# Altium schematic sheet APM9328_CPU.SchDoc
size A3; Organization: NetModule AG; Address1: Meriedweg 11; Address2: CH-3172 Niederwangen; Address4: Switzerland
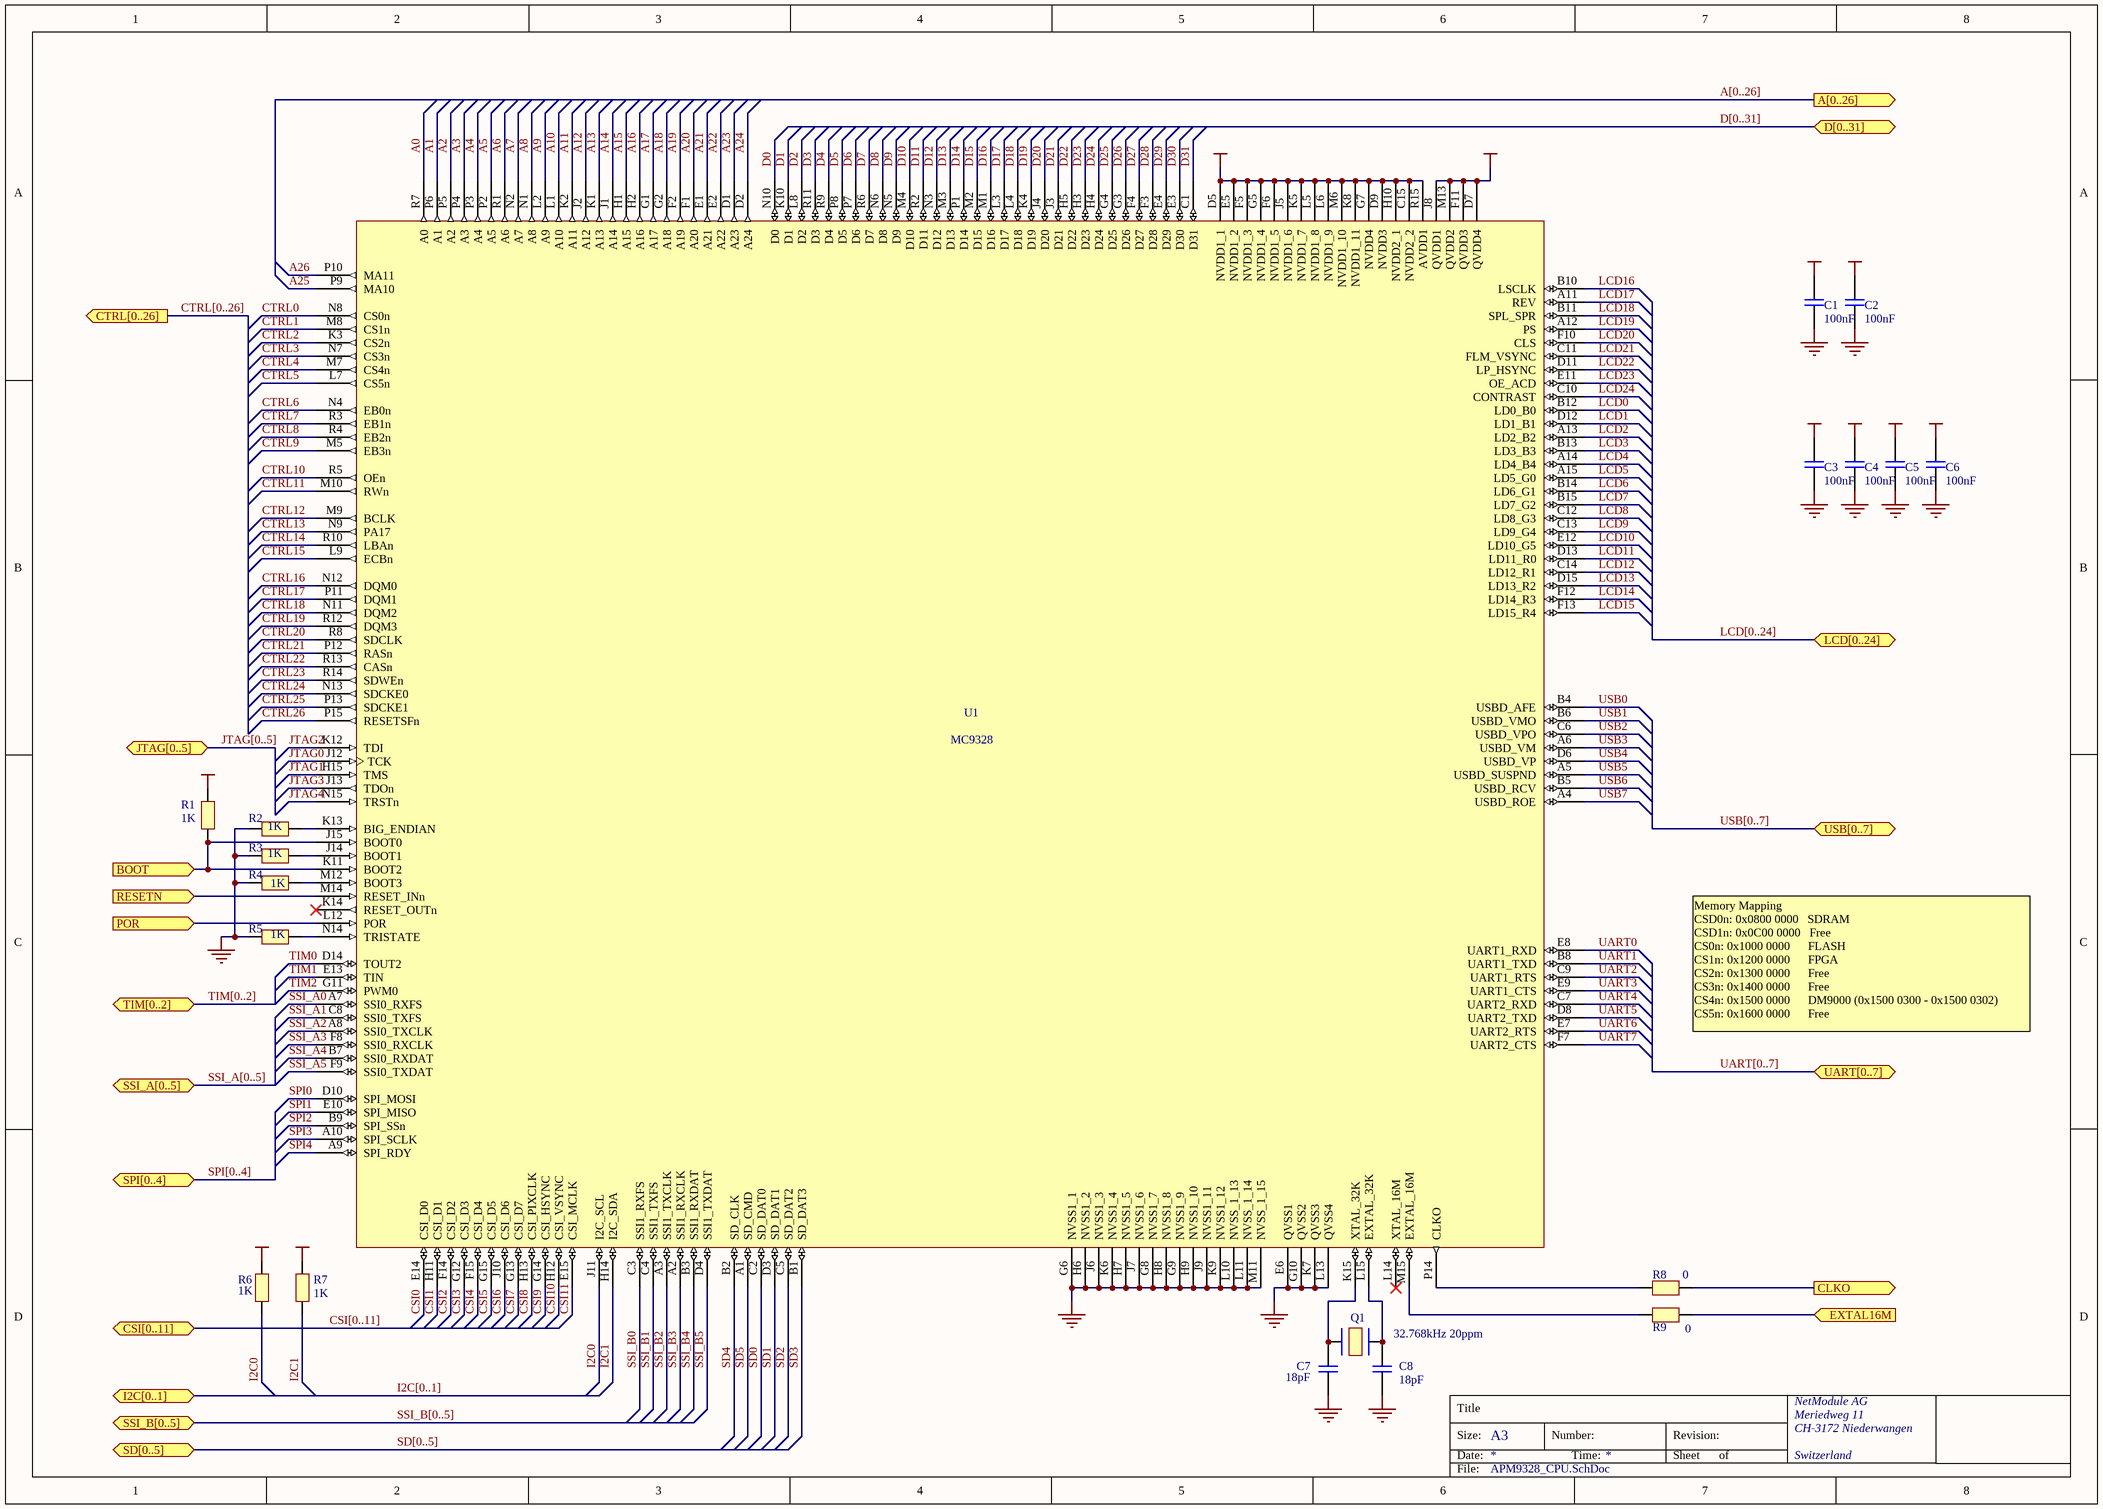
[diagram p0: APM9328_CPU.SchDoc]

## Parts
C1  100nF  [0402]
C2  100nF  [0402]
C3  100nF  [0402]
C4  100nF  [0402]
C5  100nF  [0402]
C6  100nF  [0402]
C7  18pF  [0402]
C8  18pF  [0402]
Q1  32.768kHz 20ppm  [Crystal_SMD_Cyl]
R1  1K  [0402]
R2  1K  [0402]
R3  1K  [0402]
R4  1K  [0402]
R5  1K  [0402]
R6  1K  [0402]
R7  1K  [0402]
R8  0  [0402]
R9  0  [0402]
U1  MC9328  [BGA225x15]

## Ports
A[0..26] (out), BOOT (in), CLKO (out), CSI[0..11] (bidir), CTRL[0..26] (out), D[0..31], EXTAL16M (in), I2C[0..1] (bidir), JTAG[0..5] (bidir), LCD[0..24] (bidir), POR (in), RESETN (in), SD[0..5], SPI[0..4], SSI_A[0..5] (bidir), SSI_B[0..5] (bidir), TIM[0..2], UART[0..7] (bidir), USB[0..7] (bidir)

## Nets
+1V8: C1.2 C2.2 U1.D7(QVDD4) U1.F11(QVDD3) U1.J8(QVDD1) U1.M13(QVDD2)
+3V3: C3.2 C4.2 C5.2 C6.2 R1.2 R6.2 R7.2 U1.C15(NVDD2_2) U1.D5(NVDD1_1) U1.D9(NVDD3) U1.E5(NVDD1_2) U1.F5(NVDD1_3) U1.F6(NVDD1_5) U1.G5(NVDD1_4) U1.G7(NVDD4) U1.H10(NVDD2_1) U1.J5(NVDD1_6) U1.K5(NVDD1_7) U1.K8(NVDD1_11) U1.L5(NVDD1_8) U1.L6(NVDD1_9) U1.M6(NVDD1_10) U1.R15(AVDD1)
GND: C1.1 C2.1 C3.1 C4.1 C5.1 C6.1 C7.1 C8.1 R2.1 R3.1 R4.1 R5.1 U1.E6(QVSS1) U1.G6(NVSS1_1) U1.G8(NVSS1_7) U1.G9(NVSS1_9) U1.G10(QVSS2) U1.H6(NVSS1_2) U1.H7(NVSS1_5) U1.H8(NVSS1_8) U1.H9(NVSS1_10) U1.J6(NVSS1_3) U1.J7(NVSS1_6) U1.J9(NVSS1_11) U1.K6(NVSS1_4) U1.K7(QVSS3) U1.K9(NVSS1_12) U1.L10(NVSS_1_13) U1.L11(NVSS_1_14) U1.L13(QVSS4) U1.M11(NVSS_1_15)
A0: U1.R7(A0)
A1: U1.P6(A1)
A2: U1.P5(A2)
A3: U1.P4(A3)
A4: U1.P3(A4)
A5: U1.P2(A5)
A6: U1.R1(A6)
A7: U1.N2(A7)
A8: U1.N1(A8)
A9: U1.L2(A9)
A10: U1.L1(A10)
A11: U1.K2(A11)
A12: U1.J2(A12)
A13: U1.K1(A13)
A14: U1.J1(A14)
A15: U1.H1(A15)
A16: U1.H2(A16)
A17: U1.G1(A17)
A18: U1.G2(A18)
A19: U1.F2(A19)
A20: U1.F1(A20)
A21: U1.E1(A21)
A22: U1.E2(A22)
A23: U1.D1(A23)
A24: U1.D2(A24)
A25: U1.P9(MA10)
A26: U1.P10(MA11)
BOOT: R1.1 U1.J15(BOOT0) U1.K11(BOOT2) ; port BOOT
CLKO: R8.2 ; port CLKO
CSI0: U1.E14(CSI_D0)
CSI1: U1.H11(CSI_D1)
CSI2: U1.F14(CSI_D2)
CSI3: U1.G12(CSI_D3)
CSI4: U1.F15(CSI_D4)
CSI5: U1.G15(CSI_D5)
CSI6: U1.J10(CSI_D6)
CSI7: U1.G13(CSI_D7)
CSI8: U1.H13(CSI_PIXCLK)
CSI9: U1.G14(CSI_HSYNC)
CSI10: U1.H12(CSI_VSYNC)
CSI11: U1.E15(CSI_MCLK)
CTRL0: U1.N8(CS0n)
CTRL1: U1.M8(CS1n)
CTRL2: U1.K3(CS2n)
CTRL3: U1.N7(CS3n)
CTRL4: U1.M7(CS4n)
CTRL5: U1.L7(CS5n)
CTRL6: U1.N4(EB0n)
CTRL7: U1.R3(EB1n)
CTRL8: U1.R4(EB2n)
CTRL9: U1.M5(EB3n)
CTRL10: U1.R5(OEn)
CTRL11: U1.M10(RWn)
CTRL12: U1.M9(BCLK)
CTRL13: U1.N9(PA17)
CTRL14: U1.R10(LBAn)
CTRL15: U1.L9(ECBn)
CTRL16: U1.N12(DQM0)
CTRL17: U1.P11(DQM1)
CTRL18: U1.N11(DQM2)
CTRL19: U1.R12(DQM3)
CTRL20: U1.R8(SDCLK)
CTRL21: U1.P12(RASn)
CTRL22: U1.R13(CASn)
CTRL23: U1.R14(SDWEn)
CTRL24: U1.N13(SDCKE0)
CTRL25: U1.P13(SDCKE1)
CTRL26: U1.P15(RESETSFn)
D0: U1.N10(D0)
D1: U1.K10(D1)
D2: U1.L8(D2)
D3: U1.R11(D3)
D4: U1.R9(D4)
D5: U1.P8(D5)
D6: U1.P7(D6)
D7: U1.R6(D7)
D8: U1.N6(D8)
D9: U1.N5(D9)
D10: U1.M4(D10)
D11: U1.R2(D11)
D12: U1.N3(D12)
D13: U1.M3(D13)
D14: U1.P1(D14)
D15: U1.M2(D15)
D16: U1.M1(D16)
D17: U1.L3(D17)
D18: U1.L4(D18)
D19: U1.K4(D19)
D20: U1.J4(D20)
D21: U1.J3(D21)
D22: U1.H5(D22)
D23: U1.H3(D23)
D24: U1.H4(D24)
D25: U1.G4(D25)
D26: U1.G3(D26)
D27: U1.F4(D27)
D28: U1.F3(D28)
D29: U1.E4(D29)
D30: U1.E3(D30)
D31: U1.C1(D31)
EXTAL16M: R9.2 ; port EXTAL16M
I2C0: R6.1 U1.J11(I2C_SCL)
I2C1: R7.1 U1.H14(I2C_SDA)
JTAG0: U1.J12(TCK)
JTAG1: U1.H15(TMS)
JTAG2: U1.K12(TDI)
JTAG3: U1.J13(TDOn)
JTAG4: U1.N15(TRSTn)
LCD0: U1.B12(LD0_B0)
LCD1: U1.D12(LD1_B1)
LCD2: U1.A13(LD2_B2)
LCD3: U1.B13(LD3_B3)
LCD4: U1.A14(LD4_B4)
LCD5: U1.A15(LD5_G0)
LCD6: U1.B14(LD6_G1)
LCD7: U1.B15(LD7_G2)
LCD8: U1.C12(LD8_G3)
LCD9: U1.C13(LD9_G4)
LCD10: U1.E12(LD10_G5)
LCD11: U1.D13(LD11_R0)
LCD12: U1.C14(LD12_R1)
LCD13: U1.D15(LD13_R2)
LCD14: U1.F12(LD14_R3)
LCD15: U1.F13(LD15_R4)
LCD16: U1.B10(LSCLK)
LCD17: U1.A11(REV)
LCD18: U1.B11(SPL_SPR)
LCD19: U1.A12(PS)
LCD20: U1.F10(CLS)
LCD21: U1.C11(FLM_VSYNC)
LCD22: U1.D11(LP_HSYNC)
LCD23: U1.E11(OE_ACD)
LCD24: U1.C10(CONTRAST)
POR: U1.L12(POR) ; port POR
RESETN: U1.M14(RESET_INn) ; port RESETN
SD0: U1.C2(SD_DAT0)
SD1: U1.D3(SD_DAT1)
SD2: U1.C5(SD_DAT2)
SD3: U1.B1(SD_DAT3)
SD4: U1.B2(SD_CLK)
SD5: U1.A1(SD_CMD)
SPI0: U1.D10(SPI_MOSI)
SPI1: U1.E10(SPI_MISO)
SPI2: U1.B9(SPI_SSn)
SPI3: U1.A10(SPI_SCLK)
SPI4: U1.A9(SPI_RDY)
SSI_A0: U1.A7(SSI0_RXFS)
SSI_A1: U1.C8(SSI0_TXFS)
SSI_A2: U1.A8(SSI0_TXCLK)
SSI_A3: U1.F8(SSI0_RXCLK)
SSI_A4: U1.B7(SSI0_RXDAT)
SSI_A5: U1.F9(SSI0_TXDAT)
SSI_B0: U1.C3(SSI1_RXFS)
SSI_B1: U1.C4(SSI1_TXFS)
SSI_B2: U1.A3(SSI1_TXCLK)
SSI_B3: U1.A2(SSI1_RXCLK)
SSI_B4: U1.B3(SSI1_RXDAT)
SSI_B5: U1.D4(SSI1_TXDAT)
TIM0: U1.D14(TOUT2)
TIM1: U1.E13(TIN)
TIM2: U1.G11(PWM0)
UART0: U1.E8(UART1_RXD)
UART1: U1.B8(UART1_TXD)
UART2: U1.C9(UART1_RTS)
UART3: U1.E9(UART1_CTS)
UART4: U1.C7(UART2_RXD)
UART5: U1.D8(UART2_TXD)
UART6: U1.E7(UART2_RTS)
UART7: U1.F7(UART2_CTS)
USB0: U1.B4(USBD_AFE)
USB1: U1.B6(USBD_VMO)
USB2: U1.C6(USBD_VPO)
USB3: U1.A6(USBD_VM)
USB4: U1.D6(USBD_VP)
USB5: U1.A5(USBD_SUSPND)
USB6: U1.B5(USBD_RCV)
USB7: U1.A4(USBD_ROE)
NetC7_2: C7.2 Q1.1 U1.K15(XTAL_32K)
NetC8_2: C8.2 Q1.2 U1.L15(EXTAL_32K)
NetR2_2: R2.2 U1.K13(BIG_ENDIAN)
NetR3_2: R3.2 U1.J14(BOOT1)
NetR4_2: R4.2 U1.M12(BOOT3)
NetR5_2: R5.2 U1.N14(TRISTATE)
NetR8_1: R8.1 U1.P14(CLKO)
NetR9_1: R9.1 U1.M15(EXTAL_16M)

Not connected (* = marked no-connect by the designer): U1 K14(RESET_OUTn)* L14(XTAL_16M)*

## Buses and harness runs
bus A[0..26] = port A[0..26]
bus CSI[0..11] = port CSI[0..11]
bus CTRL[0..26] = port CTRL[0..26]
bus D[0..31] = port D[0..31]
bus I2C[0..1] = port I2C[0..1]
bus JTAG[0..5] = port JTAG[0..5]
bus LCD[0..24] = port LCD[0..24]
bus SD[0..5] = port SD[0..5]
bus SPI[0..4] = port SPI[0..4]
bus SSI_A[0..5] = port SSI_A[0..5]
bus SSI_B[0..5] = port SSI_B[0..5]
bus TIM[0..2] = port TIM[0..2]
bus UART[0..7] = port UART[0..7]
bus USB[0..7] = port USB[0..7]

## Notes on the sheet
- Memory Mapping
  CSD0n: 0x0800 0000   SDRAM
  CSD1n: 0x0C00 0000   Free
  CS0n: 0x1000 0000      FLASH
  CS1n: 0x1200 0000      FPGA
  CS2n: 0x1300 0000      Free
  CS3n: 0x1400 0000      Free
  CS4n: 0x1500 0000      DM9000 (0x1500 0300 - 0x1500 0302)
  CS5n: 0x1600 0000      Free
- Title
- Size:
- Date:
- A3
- Number:
- Time:
- Revision:
- Sheet
- of
- File:

## Library data of the parts
C1-C8 = Cap
Q1 = QUARTZ: Manufacturer: Citizen; Part Number: CMR200TB32.768KDZFTR; Distributor: Digikey; Second Source: *; Price_100: 0,4; Price_500: 0,33; Price_1000: 0,3
R1-R9 = Res
U1 = MC9328MXL: Manufacturer: Freescale; Part Number: *; Distributor: *; Price_100: *; Assembly Option: *